# EAGLE board pandashield (EAGLE 6.0), part 1 of 2
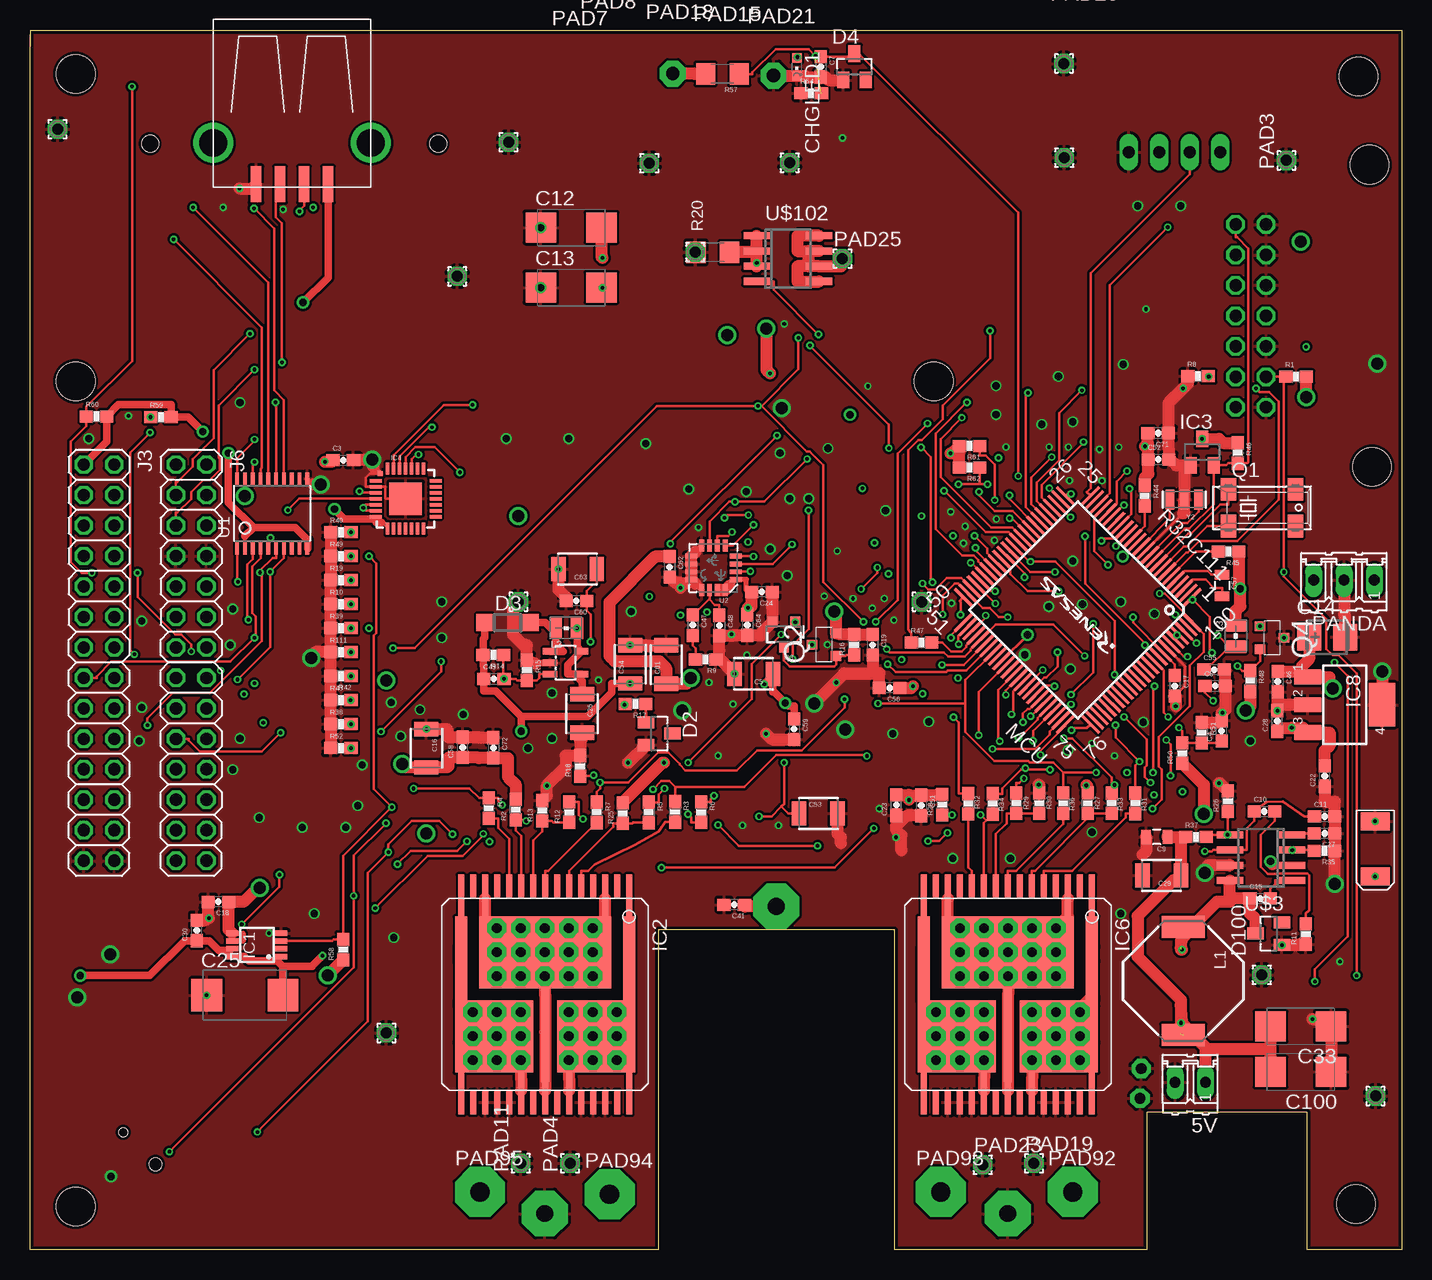
[diagram p9: board, top side]
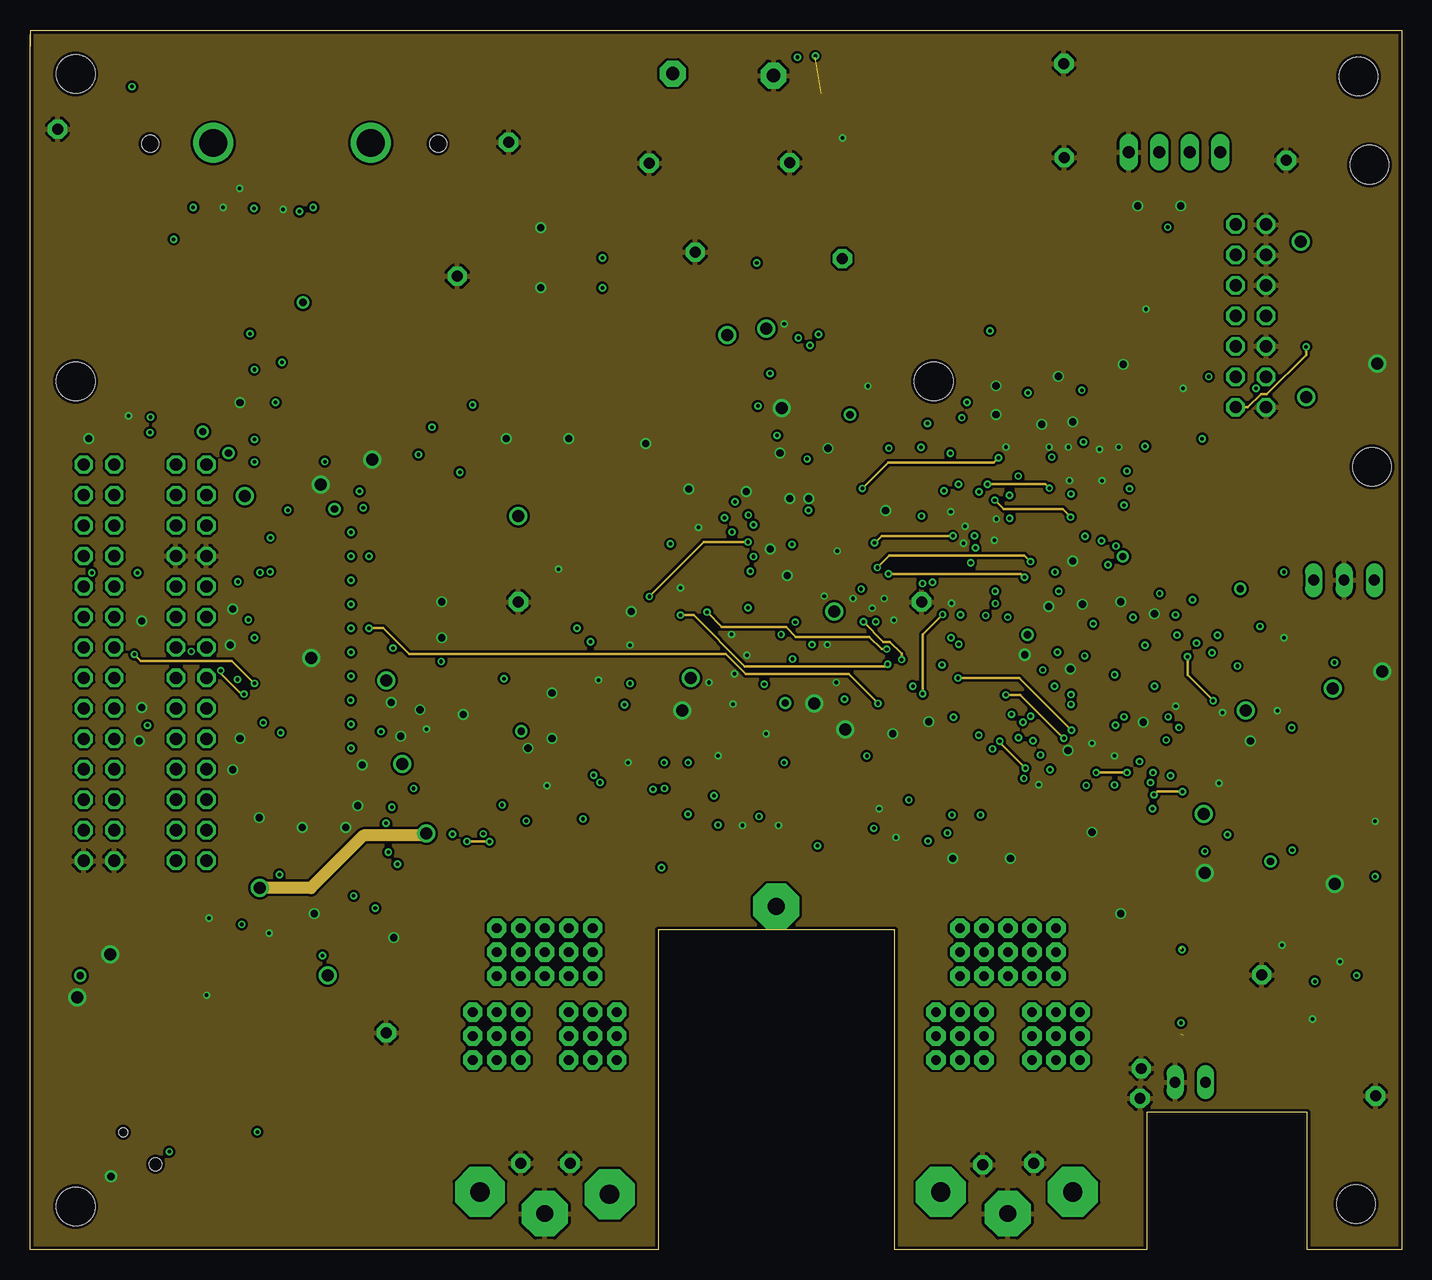
[diagram p10: board, inner layer Route2]
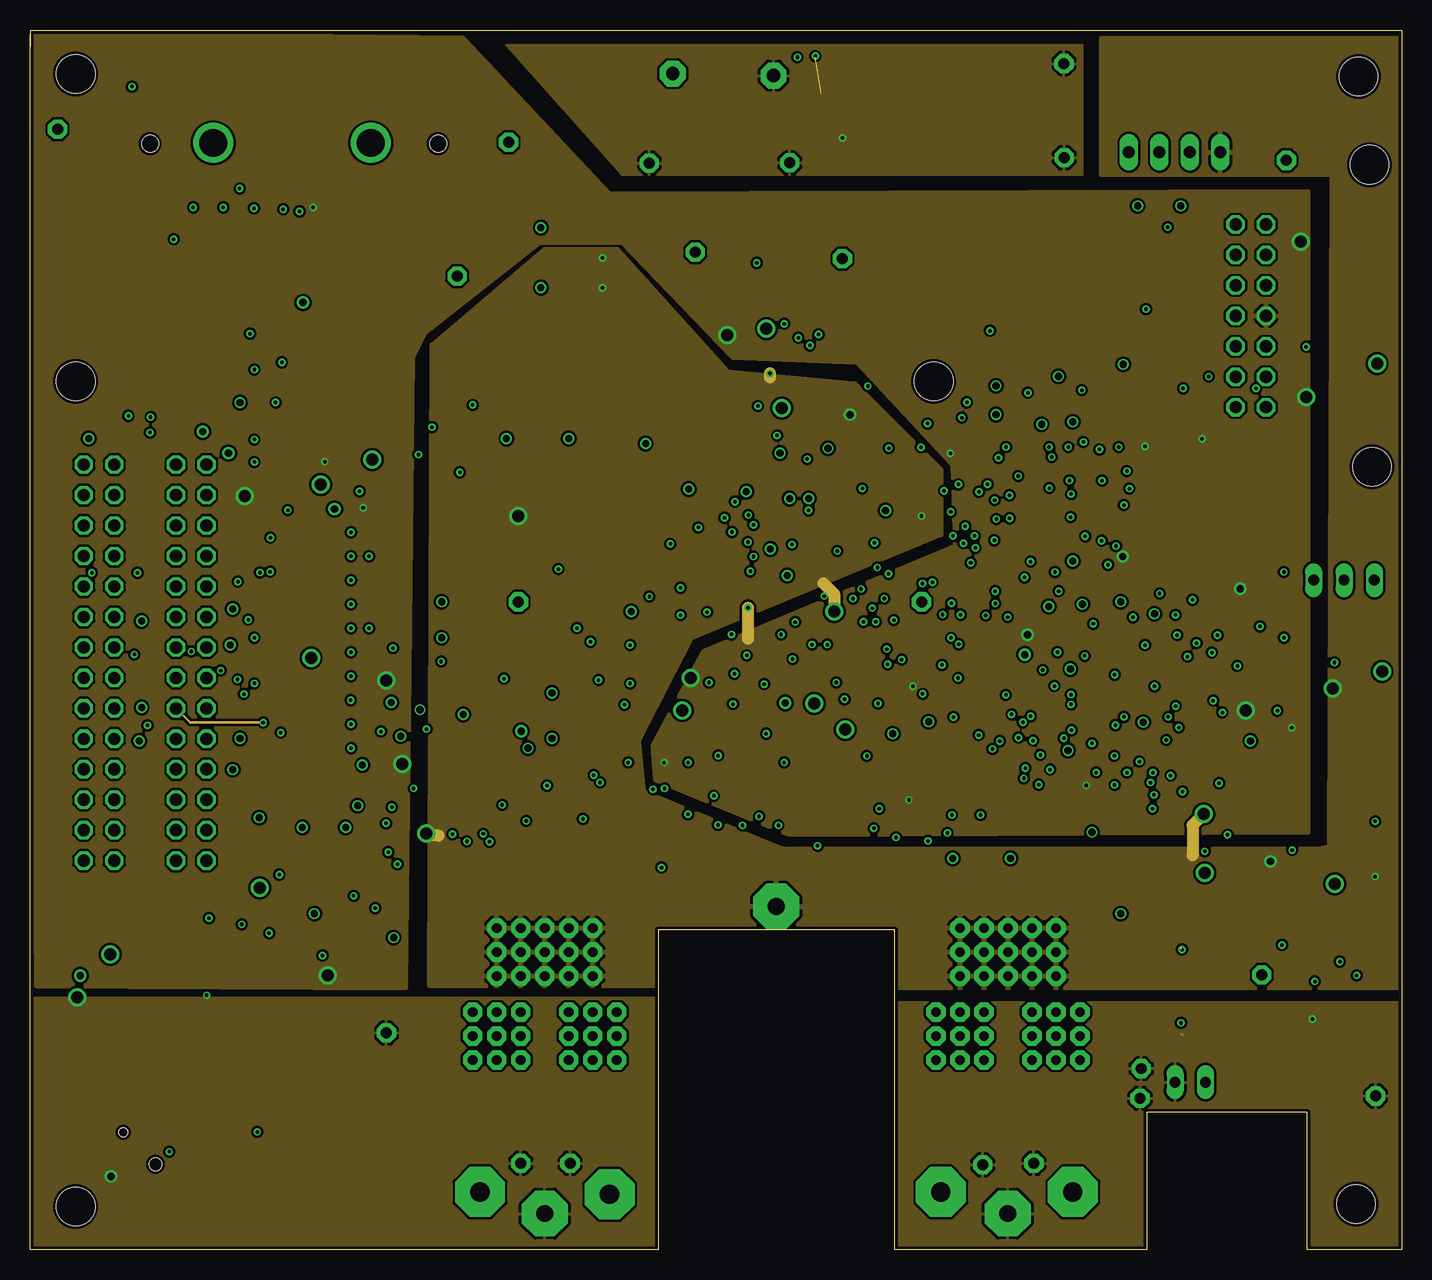
[diagram p11: board, inner layer Route15]
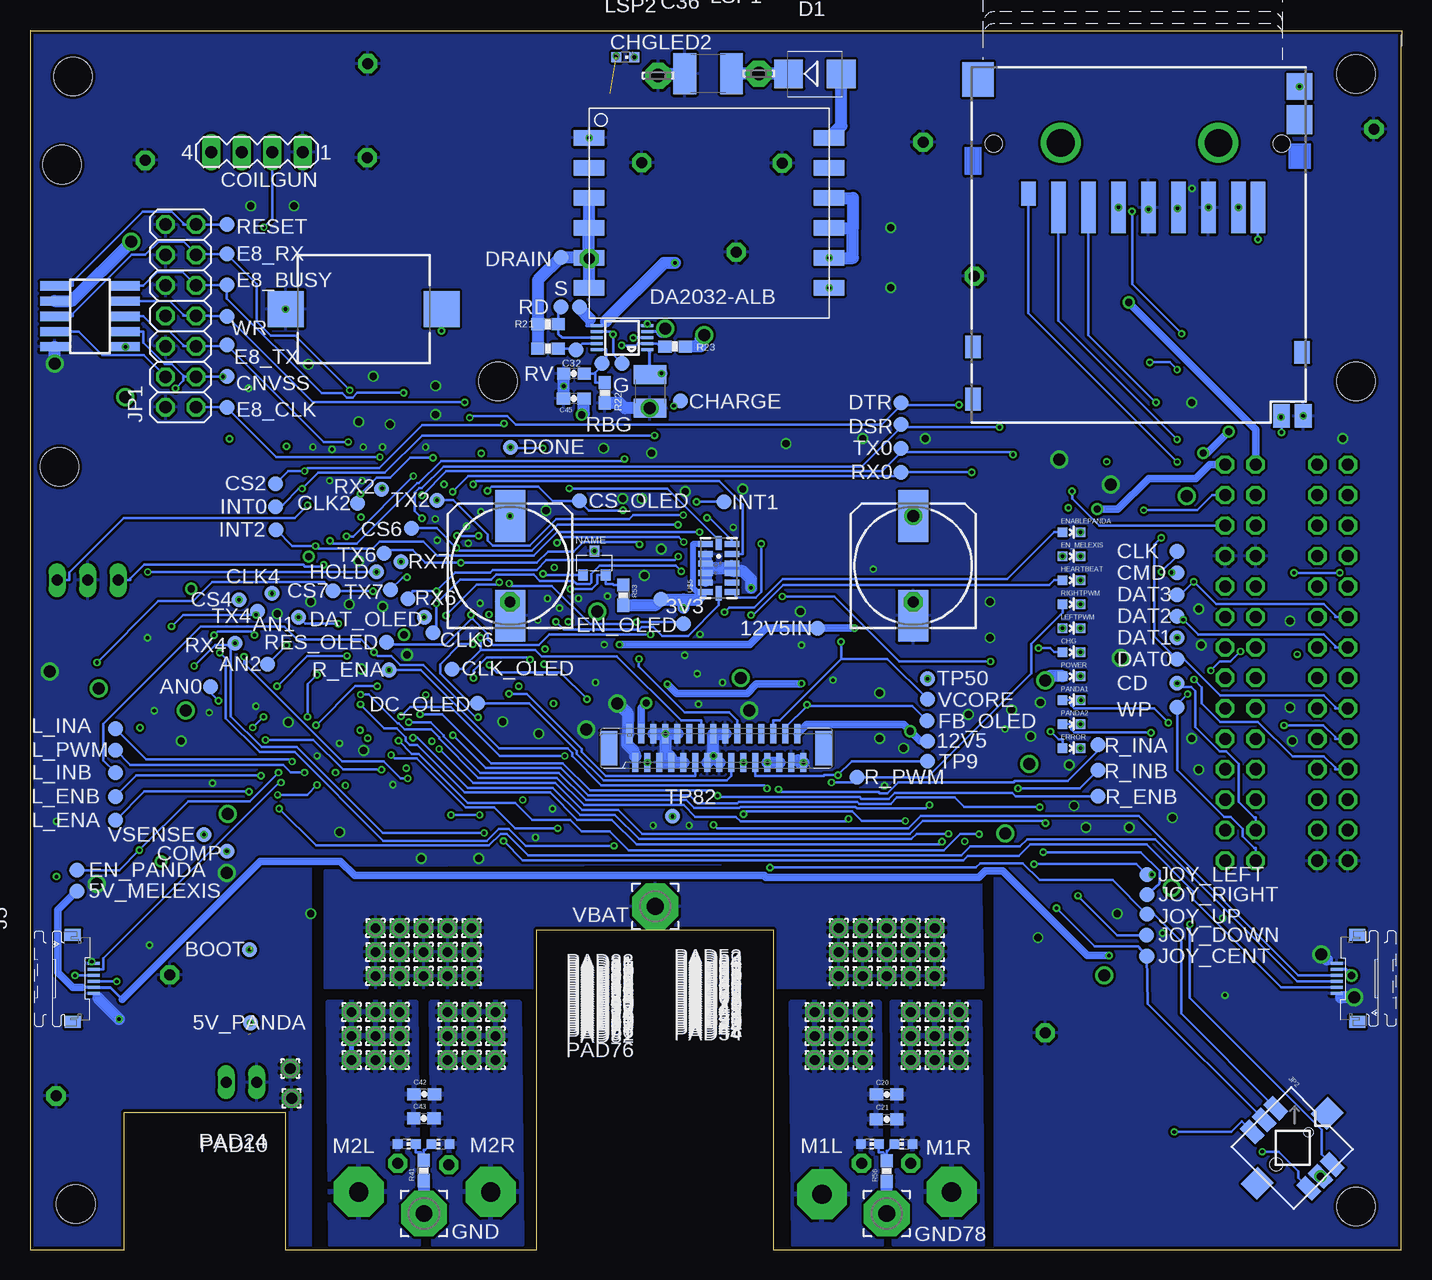
[diagram p12: board, bottom side, seen from below]

Size 114.3 x 101.67 mm. Coordinates in mm from the lower left corner, seen from the top.
Outline: 0.02,101.27 0.02,0 32.3,0 33.1,0 33.5,0 33.7,0 33.9,0 34.7,0 52.36,0 52.36,26.67 72.08,26.67 72.08,0 89.9,0 90.1,0 93.05,0 93.05,11.43 106.45,11.43 106.45,0 114.3,0 114.3,101.6
Outline: 114.3,101.67 114.3,101.6
Outline: 114.3,101.6 39.7,101.6 0,101.6 0,100.33
Copper layers (1*2+15*16): Top 0.035mm / dielectric 1.5mm / Route2 0.035mm / dielectric 0.15mm / Route15 0.035mm / dielectric 0.2mm / Bottom 0.035mm
Design rules: minimum track width 6mil, minimum drill 0.3mm, track to track 6mil, track to pad 6mil, pad to pad 6mil, via to via 6mil, smd to smd 0mil, copper to edge 10mil, drill to drill 10mil, minimum pad ring 10mil, minimum via ring 6mil, stop-mask expansion 2mil, vias tented up to drill 100mil, thermal gap 10mil
Net classes: 0 default: width 0.203 mm, drill 0.152 mm, clearance 0.203 mm; 1 power: width 0.635 mm, drill 0.305 mm, clearance 0.203 mm; 2 morepower: width 1.016 mm, drill 0.508 mm, clearance 0.203 mm
Holes 3.2 mm at 110.49,3.81 3.81,3.59 3.81,98.01 110.71,97.79 3.81,72.39 75.31,72.39 111.85,65.26 111.63,90.44

## Footprints (pad centres in the part's own frame; a part is rotated, then mirrored left to right if it is on the bottom)
B1,27 = smd 1.27 x 1.27: TP 0,0
02P = drill 0.914 long: 1 -1.27,0; 2 1.27,0
EIA6032 = smd 1.5 x 2.4: P$1 -2.3,0; P$2 2.3,0
153CLV-1014 = smd 4.3 x 2.5: + 4.15,0; - -4.15,0
0603-CAP = smd 1.1 x 1: 1 -0.85,0; 2 0.85,0
1210 = smd 1.2 x 2: 1 -1.6,0; 2 1.6,0
0805 = smd 0.8 x 1.2: 1 -0.9,0; 2 0.9,0
C/6032-28R = smd 2.55 x 2.5: + 2.525,0; - -2.525,0
CT3528 = smd 2 x 2.2: + -1.5,0; - 1.5,0
D/7343-31R = smd 2.55 x 2.7: + 3.175,0; - -3.175,0
C1210 = smd 1.6 x 2.7: 1 -1.4,0; 2 1.4,0
C1812 = smd 1.9 x 3.4: 1 -1.95,0; 2 1.95,0
LED-0603 = smd 0.8 x 0.8: A 0,-0.75; C 0,0.75
CHIPLED_0603 = smd 0.8 x 0.8: A 0,-0.75; C 0,0.75
MA04-1 = drill 1.016 long: 1 -3.81,0; 2 -1.27,0; 3 1.27,0; 4 3.81,0
SMB = smd 2.4 x 2.4: A 2.2,0; C -2.2,0
SOT23 = smd 1 x 1.4: 1 -0.95,-1.1; 2 0.95,-1.1; 3 0,1.1
SOD123 = smd 1.4 x 1.4: A 1.9,0; C -1.9,0
3,81/1,4 = drill 1.397 pad 3.81 octagon: 1 0,0
MSOP8 = smd 0.45 x 1: 1 -0.975,-2.05; 2 -0.325,-2.05; 3 0.325,-2.05; 4 0.975,-2.05; 5 0.975,2.05; 6 0.325,2.05; 7 -0.325,2.05; 8 -0.975,2.05
MULTIPOWERSO-30 = smd 0.508 x 12: 1 -7,-4; 15 7,-4; 16 7,4; 30 -7,4 | smd 0.508 x 2: 2 -6,-9; 4 -4,-9; 5 -3,-9; 6 -2,-9; 7 -1,-9; 8 0,-9; 9 1,-9; 10 2,-9; 11 3,-9; 12 4,-9; 14 6,-9; 17 6,9; 18 5,9; 19 4,9; 20 3,9; 22 1,9; 24 -1,9; 26 -3,9; 27 -4,9; 28 -5,9; 29 -6,9 | smd 0.508 x 4: 3 -5,-8; 13 5,-8; 21 2,8; 23 0,8; 25 -2,8 | smd 6.5 x 6: OUTA -4.25,3.5; OUTB 4.25,3.5 | smd 1 x 7.5: OUTA@1 -7,-2.755; OUTB@1 7,-2.755 | smd 11 x 6: VCC 0,-3.5 | smd 0.65 x 8.3: VCC@1 0,3.145
SOT23B-3 = smd 1 x 1.4: 1 -0.95,-1.1; 2 0.95,-1.1; 3 0,1.1
MLP28 = smd 1 x 0.3: 1 -2.5,1.5; 2 -2.5,1; 3 -2.5,0.5; 4 -2.5,0; 5 -2.5,-0.5; 6 -2.5,-1; 7 -2.5,-1.5; 15 2.5,-1.5; 16 2.5,-1; 17 2.5,-0.5; 18 2.5,0; 19 2.5,0.5; 20 2.5,1; 21 2.5,1.5 | smd 0.3 x 1: 8 -1.5,-2.5; 9 -1,-2.5; 10 -0.5,-2.5; 11 0,-2.5; 12 0.5,-2.5; 13 1,-2.5; 14 1.5,-2.5; 22 1.5,2.5; 23 1,2.5; 24 0.5,2.5; 25 0,2.5; 26 -0.5,2.5; 27 -1,2.5; 28 -1.5,2.5 | smd 2.7 x 2.7: EXP 0,0 | smd 0.435 x 0.435: M -2.103,2.103
SOT223 = smd 1.219 x 2.235: 1 -2.311,-3.099; 2 0,-3.099; 3 2.311,-3.099 | smd 3.6 x 2.2: 4 0,3.099
XF2J-3024-11 = smd 1.6 x 0.5: 1 1.2,7.25; 2 -1.2,6.75; 3 1.2,6.25; 4 -1.2,5.75; 5 1.2,5.25; 6 -1.2,4.75; 7 1.2,4.25; 8 -1.2,3.75; 9 1.2,3.25; 10 -1.2,2.75; 11 1.2,2.25; 12 -1.2,1.75; 13 1.2,1.25; 14 -1.2,0.75; 15 1.2,0.25; 16 -1.2,-0.25; 17 1.2,-0.75; 18 -1.2,-1.25; 19 1.2,-1.75; 20 -1.2,-2.25; 21 1.2,-2.75; 22 -1.2,-3.25; 23 1.2,-3.75; 24 -1.2,-4.25; 25 1.2,-4.75; 26 -1.2,-5.25; 27 1.2,-5.75; 28 -1.2,-6.25; 29 1.2,-6.75; 30 -1.2,-7.25 | smd 2.9 x 1.4: M1 0,8.95; M2 0,-8.95
2X14 = drill 1.016 octagon: 1 -16.51,-1.27; 2 -16.51,1.27; 3 -13.97,-1.27; 4 -13.97,1.27; 5 -11.43,-1.27; 6 -11.43,1.27; 7 -8.89,-1.27; 8 -8.89,1.27; 9 -6.35,-1.27; 10 -6.35,1.27; 11 -3.81,-1.27; 12 -3.81,1.27; 13 -1.27,-1.27; 14 -1.27,1.27; 15 1.27,-1.27; 16 1.27,1.27; 17 3.81,-1.27; 18 3.81,1.27; 19 6.35,-1.27; 20 6.35,1.27; 21 8.89,-1.27; 22 8.89,1.27; 23 11.43,-1.27; 24 11.43,1.27; 25 13.97,-1.27; 26 13.97,1.27; 27 16.51,-1.27; 28 16.51,1.27
XF2L-0625-1 = smd 1 x 0.25: 1 1.905,1.25; 2 1.905,0.75; 3 1.905,0.25; 4 1.905,-0.25; 5 1.905,-0.75; 6 1.905,-1.25 | smd 1.34 x 1: M1 0.18,3.638; M2 0.18,-3.638
2X07 = drill 1.016 octagon: 1 -7.62,-1.27; 2 -7.62,1.27; 3 -5.08,-1.27; 4 -5.08,1.27; 5 -2.54,-1.27; 6 -2.54,1.27; 7 0,-1.27; 8 0,1.27; 9 2.54,-1.27; 10 2.54,1.27; 11 5.08,-1.27; 12 5.08,1.27; 13 7.62,-1.27; 14 7.62,1.27
JOYSTICK_MINI = smd 1.85 x 1.1: A 0,2.8; B 6.65,2.8; C 0,0; CTR 0,1.4; D 6.65,0; GND 6.65,1.4 | smd 1.9 x 2: NC 3.325,5.53; NC@0 3.33,-2.72 | hole 0.75: 3.34,3.295 | hole 1.05: 3.325,-0.5
SRU1038 = smd 1.8 x 3.6: 1 -4.5,0; 2 4.5,0
WE-KI_0805_B = smd 1.02 x 1.78: 1 -0.89,0; 2 0.89,0
LSP11 = drill 1.118 pad 2.159 octagon: MP 0,0
MSOP = smd 0.25 x 1: 1 -1,-2.113; 2 -0.5,-2.113; 3 0,-2.113; 4 0.5,-2.113; 5 1,-2.113; 6 1,2.113; 7 0.5,2.113; 8 0,2.113; 9 -0.5,2.113; 10 -1,2.113
CHIP-LED0603 = smd 0.8 x 0.8: A 0,-0.75; C 0,0.75
100P6Q-A = smd 0.25 x 2: 1 -6,-7.5; 2 -5.5,-7.5; 3 -5,-7.5; 4 -4.5,-7.5; 5 -4,-7.5; 6 -3.5,-7.5; 7 -3,-7.5; 8 -2.5,-7.5; 9 -2,-7.5; 10 -1.5,-7.5; 11 -1,-7.5; 12 -0.5,-7.5; 13 0,-7.5; 14 0.5,-7.5; 15 1,-7.5; 16 1.5,-7.5; 17 2,-7.5; 18 2.5,-7.5; 19 3,-7.5; 20 3.5,-7.5; 21 4,-7.5; 22 4.5,-7.5; 23 5,-7.5; 24 5.5,-7.5; 25 6,-7.5; 51 6,7.5; 52 5.5,7.5; 53 5,7.5; 54 4.5,7.5; 55 4,7.5; 56 3.5,7.5; 57 3,7.5; 58 2.5,7.5; 59 2,7.5; 60 1.5,7.5; 61 1,7.5; 62 0.5,7.5; 63 0,7.5; 64 -0.5,7.5; 65 -1,7.5; 66 -1.5,7.5; 67 -2,7.5; 68 -2.5,7.5; 69 -3,7.5; 70 -3.5,7.5; 71 -4,7.5; 72 -4.5,7.5; 73 -5,7.5; 74 -5.5,7.5; 75 -6,7.5 | smd 2 x 0.25: 26 7.5,-6; 27 7.5,-5.5; 28 7.5,-5; 29 7.5,-4.5; 30 7.5,-4; 31 7.5,-3.5; 32 7.5,-3; 33 7.5,-2.5; 34 7.5,-2; 35 7.5,-1.5; 36 7.5,-1; 37 7.5,-0.5; 38 7.5,0; 39 7.5,0.5; 40 7.5,1; 41 7.5,1.5; 42 7.5,2; 43 7.5,2.5; 44 7.5,3; 45 7.5,3.5; 46 7.5,4; 47 7.5,4.5; 48 7.5,5; 49 7.5,5.5; 50 7.5,6; 76 -7.5,6; 77 -7.5,5.5; 78 -7.5,5; 79 -7.5,4.5; 80 -7.5,4; 81 -7.5,3.5; 82 -7.5,3; 83 -7.5,2.5; 84 -7.5,2; 85 -7.5,1.5; 86 -7.5,1; 87 -7.5,0.5; 88 -7.5,0; 89 -7.5,-0.5; 90 -7.5,-1; 91 -7.5,-1.5; 92 -7.5,-2; 93 -7.5,-2.5; 94 -7.5,-3; 95 -7.5,-3.5; 96 -7.5,-4; 97 -7.5,-4.5; 98 -7.5,-5; 99 -7.5,-5.5; 100 -7.5,-6
1,6/0,9 = drill 0.914 pad 1.6 octagon: 1 0,0
1,6/0,8 = drill 0.813 pad 1.6 octagon: 1 0,0
4,16O1,6 = drill 1.6 pad 4.166 octagon: 1 0,0
03P = drill 0.914 long: 1 -2.54,0; 2 0,0; 3 2.54,0
MM20SS = smd 1.27 x 1.88: 1 -2.794,-1.524; 2 2.794,-1.524; 3 2.794,1.524; 4 -2.794,1.524
MICRO3 = smd 0.8 x 0.9: 1 -0.95,-1; 2 0.95,-1; 3 0,1
SOT23-3 = smd 0.8 x 0.9: 1 -0.95,-1; 2 0.95,-1; 3 0,1.1
0603-RES = smd 1.1 x 1: 1 -0.85,0; 2 0.85,0
1206 = smd 1.6 x 1.8: 1 -1.4,0; 2 1.4,0
BUZZER-CMT1102 = smd 3 x 3: 1 -6.5,0; 2 6.5,0
TSSOP20 = smd 0.305 x 0.991: 1 -2.925,-2.918; 2 -2.275,-2.918; 3 -1.625,-2.918; 4 -0.975,-2.918; 5 -0.325,-2.918; 6 0.325,-2.918; 7 0.975,-2.918; 8 1.625,-2.918; 9 2.275,-2.918; 10 2.925,-2.918; 11 2.925,2.918; 12 2.275,2.918; 13 1.625,2.918; 14 0.975,2.918; 15 0.325,2.918; 16 -0.325,2.918; 17 -0.975,2.918; 18 -1.625,2.918; 19 -2.275,2.918; 20 -2.925,2.918
LGA16-4X4 = smd 1 x 0.4: 1 -1.85,0.975; 2 -1.85,0.325; 3 -1.85,-0.325; 4 -1.85,-0.975; 9 1.85,-0.975; 10 1.85,-0.325; 11 1.85,0.325; 12 1.85,0.975 | smd 0.4 x 1: 5 -0.975,-1.85; 6 -0.325,-1.85; 7 0.325,-1.85; 8 0.975,-1.85; 13 0.975,1.85; 14 0.325,1.85; 15 -0.325,1.85; 16 -0.975,1.85
DA2032-ALB = smd 2.54 x 1.27: 1 -10,6.27; 2 -10,3.77; 3 -10,1.27; 4 -10,-1.23; 5 -10,-3.73; 6 -10,-6.23; 7 10,-6.23; 8 10,-3.73; 9 10,-1.23; 10 10,1.27; 11 10,3.77; 12 10,6.27
SOT23-DBV = smd 0.55 x 1.2: 1 -0.95,-1.3; 2 0,-1.3; 3 0.95,-1.3; 4 0.95,1.3; 5 -0.95,1.3
SO8 = smd 0.6 x 2.2: 1 -1.905,-2.6; 2 -0.635,-2.6; 3 0.635,-2.6; 4 1.905,-2.6; 5 1.905,2.6; 6 0.635,2.6; 7 -0.635,2.6; 8 -1.905,2.6
LGA14 = smd 0.5 x 1.2: 1 2,1.1; 2 1.2,1.1; 3 0.4,1.1; 4 -0.4,1.1; 5 -1.2,1.1; 6 -2,1.1; 8 -2,-1.1; 9 -1.2,-1.1; 10 -0.4,-1.1; 11 0.4,-1.1; 12 1.2,-1.1; 13 2,-1.1 | smd 1.2 x 0.5: 7 -2.1,0; 14 2.1,0
1365-10 = smd 0.76 x 2.4: 1 -2.54,-2.95; 2 -2.54,2.95; 3 -1.27,-2.95; 4 -1.27,2.95; 5 0,-2.95; 6 0,2.95; 7 1.27,-2.95; 8 1.27,2.95; 9 2.54,-2.95; 10 2.54,2.95
USB-A-S = smd 3 x 0.9: D+ 3.45,-1; D- 3.45,1; GND 3.45,-3; VBUS 3.45,3 | drill 2.311: P$5 0,-6.566; P$6 0,6.566
SDBMF-009XXBXX2 = smd 1.2 x 4.3: 1 6.7,5.325; 2 4.2,5.325; 3 1.7,5.325; 4 -0.8,5.325; 5 -3.3,5.325; 6 -5.8,5.325; 7 -8.3,5.325; 8 -9.925,5.325 | smd 1.2 x 2: 9 9.2,4.175 | smd 2.1 x 2.4: M1 -13.4,-2 | smd 2.6 x 2.9: M2 13.4,-5.35 | smd 1.3 x 1.9: M3 -13.6,17.4; M4 13.8,16.95; M5 13.8,21.3 | smd 1.4 x 1.95: SW1 -11.9,22.7; SW3 -13.7,22.7 | smd 2.1 x 2.2: SW2 -13.4,-4.75 | hole 1.4: -11.9,0; 12.1,0
RESONATOR-SMD = smd 0.7 x 1.7: 1 -1.2,0; 2 0,0; 3 1.2,0

## Placement (x,y rotation side)
3V3  TPB1,27  [B1,27]  61.7,54.2 90 bottom
5V  [02P]  96.69,13.95 180 top
5V_MELEXIS  TPB1,27  [B1,27]  110.4,29.88 0 bottom
5V_PANDA  TPB1,27  [B1,27]  95.92,18.9 0 bottom
10UF/16V  [EIA6032]  112.1,33.4 90 top
12V5  TPB1,27  [B1,27]  39.52,42.4 0 bottom
12V5IN  TPB1,27  [B1,27]  48.67,51.81 90 bottom
AN0  TPB1,27  [B1,27]  99.27,46.92 0 bottom
AN1  TPB1,27  [B1,27]  91.92,52.71 0 bottom
AN2  TPB1,27  [B1,27]  94.5,48.8 0 bottom
BOOT  TPB1,27  [B1,27]  96,25.01 0 bottom
C1  820uF/16V  [153CLV-1014]  74.3,57 90 bottom
C2  820uF/16V  [153CLV-1014]  40.7,57 90 bottom
C3  0.1  [0603-CAP]  26.1,65.8 0 top
C4  33nF  [0603-CAP]  99.29,43.24 90 top
C5  10uF  [1210]  60.3,48 180 top
C7  33n  [0603-CAP]  65.9,98.6 270 top
C8  33nF  [0603-CAP]  98.76,47 0 top
C9  4,7uF/6.3V  [0805]  93.9,34.4 180 top
C10  180pF  [0603-CAP]  102.87,36.53 0 top
C11  12pF  [0603-CAP]  107.89,36.11 0 top
C12  100uF/16V  [C/6032-28R]  45.1,85.2 0 top
C13  100uF/16V  [C/6032-28R]  45.1,80.2 0 top
C14  22,0  [CT3528]  108.1,51.05 0 top
C15  0.1  [0603-CAP]  102.51,29.26 0 top
C16  10,0  [1210]  33.04,41.79 270 top
C17  33nF  [0603-CAP]  95.4,47 270 top
C18  0.1  [0603-CAP]  15.7,29 180 top
C19  0,1  [0603-CAP]  70.21,50.42 270 top
C20  0,1  [0603-CAP]  42.92,12.93 0 bottom
C21  0,22  [0603-CAP]  42.92,10.86 0 bottom
C22  0,1  [0603-CAP]  107.9,39.48 90 top
C23  0,1  [0603-CAP]  72.2,37.06 90 top
C24  10n  [0603-CAP]  61,54.83 180 top
C25  [D/7343-31R]  17.9,21.2 0 top
C26  10,0  [1210]  46,44.68 270 top
C27  15nF  [0603-CAP]  107.88,34.7 180 top
C28  0.1  [0603-CAP]  103.94,44.07 90 top
C29  10uF/6.3V  [1210]  94.3,31.2 180 top
C30  0.1  [0603-CAP]  13.9,26.6 90 top
C31  10u  [C1210]  62.63,71.54 270 bottom
C32  100p  [0603-CAP]  68.97,73.02 180 bottom
C33  47uF/16V  [C/6032-28R]  105.9,18.6 180 top
C36  0.1uF 600V  [C1812]  57.78,98.03 180 bottom
C41  0,1  [0603-CAP]  58.69,28.75 180 top
C42  0,1  [0603-CAP]  81.45,12.96 0 bottom
C43  0,22  [0603-CAP]  81.48,10.93 0 bottom
C45  0.1  [0603-CAP]  68.98,70.94 180 bottom
C46  1uF  [0603-CAP]  103.98,47.35 270 top
C47  470nF  [0603-CAP]  55.23,52.05 270 top
C48  10nF  [0603-CAP]  57.45,52.04 270 top
C49  100p  [0603-CAP]  38.65,47.58 0 top
C51  0,1  [0603-CAP]  74.27,37.03 270 top
C52  0,1  [0603-CAP]  94.04,65.87 0 top
C53  10uF  [1210]  65.69,36.36 0 top
C54  10uF  [1210]  50.01,48.79 90 top
C55  0,1  [0603-CAP]  98.68,48.35 0 top
C56  0,1  [0603-CAP]  71.63,46.81 180 top
C57  4,7uF  [0805]  99.34,55.36 270 top
C58  0,1  [0603-CAP]  36.07,41.86 90 top
C59  0.1  [0603-CAP]  63.68,43.38 270 top
C60  0.1  [0603-CAP]  45.54,54.08 180 top
C61  10uF  [1210]  53.02,48.76 90 top
C62  0.1  [0603-CAP]  53.29,56.91 270 top
C63  10uF  [1210]  45.63,56.73 180 top
C64  0.1  [0603-CAP]  59.78,52.07 270 top
C71  0,1  [0603-CAP]  94.01,68.06 180 top
C72  0,1  [0603-CAP]  38.62,41.82 270 top
C100  47uF/16V  [C/6032-28R]  105.9,14.8 180 top
CD  TPB1,27  [B1,27]  18.7,47.2 0 bottom
CHARGE  TPB1,27  [B1,27]  60.11,70.74 90 bottom
CHG  [LED-0603]  27.5,49.8 270 bottom
CHGLED1  [CHIPLED_0603]  63.9,98.6 180 top
CHGLED2  [CHIPLED_0603]  64.7,99.4 270 bottom
CLK  TPB1,27  [B1,27]  18.7,58.2 0 bottom
CLK2  TPB1,27  [B1,27]  87,62.2 0 bottom
CLK4  TPB1,27  [B1,27]  94.14,54.69 0 bottom
CLK6  TPB1,27  [B1,27]  80.71,51.4 0 bottom
CLK_OLED  TPB1,27  [B1,27]  79.12,48.39 90 bottom
CMD  TPB1,27  [B1,27]  18.7,56.4 0 bottom
CNVSS  TPB1,27  [B1,27]  97.9,72.8 0 bottom
COILGUN  [MA04-1]  95.38,91.49 180 bottom
COMP  TPB1,27  [B1,27]  97.9,33.2 0 bottom
CS2  TPB1,27  [B1,27]  93.83,63.85 0 bottom
CS4  TPB1,27  [B1,27]  96.88,54.17 0 bottom
CS6  TPB1,27  [B1,27]  82.51,60.13 180 bottom
CS7  TPB1,27  [B1,27]  89.04,54.91 0 bottom
CS_OLED  TPB1,27  [B1,27]  68.51,62.4 270 bottom
D1  MURS160  [SMB]  48.89,98.01 0 bottom
D2  BAS70-04  [SOT23]  52.43,43.01 270 top
D3  MBR0530  [SOD123]  39.8,52.26 0 top
D4  BAT54  [SOT23]  68.7,98.6 0 top
D100  BAT54  [SOT23]  103.23,26.34 90 top
DAT0  TPB1,27  [B1,27]  18.7,49.2 0 bottom
DAT1  TPB1,27  [B1,27]  18.7,51 0 bottom
DAT2  TPB1,27  [B1,27]  18.7,52.8 0 bottom
DAT3  TPB1,27  [B1,27]  18.7,54.6 0 bottom
DAT_OLED  TPB1,27  [B1,27]  81.41,52.72 0 bottom
DC_OLED  TPB1,27  [B1,27]  77.03,45.53 180 bottom
DONE  TPB1,27  [B1,27]  74.25,66.89 0 bottom
DRAIN  TPB1,27  [B1,27]  70.05,82.72 90 bottom
DSR  TPB1,27  [B1,27]  41.7,68.8 0 bottom
DTR  TPB1,27  [B1,27]  41.7,70.6 0 bottom
E8_BUSY  TPB1,27  [B1,27]  97.9,80.4 0 bottom
E8_CLK  TPB1,27  [B1,27]  97.9,70.2 0 bottom
E8_RX  TPB1,27  [B1,27]  97.9,83 0 bottom
E8_TX  TPB1,27  [B1,27]  97.9,75.4 0 bottom
EN_MELEXIS  [LED-0603]  27.5,57.8 270 bottom
EN_OLED  TPB1,27  [B1,27]  59.83,52.16 180 bottom
EN_PANDA  TPB1,27  [B1,27]  110.4,31.63 0 bottom
ENABLEPANDA  [LED-0603]  27.5,59.8 270 bottom
ERROR  [LED-0603]  27.5,41.8 270 bottom
FB_OLED  TPB1,27  [B1,27]  39.53,44.09 90 bottom
G  TPB1,27  [B1,27]  64.97,73.88 90 bottom
GND  [3,81/1,4]  81.47,3 0 bottom
GND78  [3,81/1,4]  42.9,3 0 bottom
HEARTBEAT  [LED-0603]  27.5,55.8 270 bottom
HOLD  TPB1,27  [B1,27]  85.42,56.49 0 bottom
IC1  TPS773  [MSOP8]  18.9,25.4 90 top
IC2  VNH2SP30TR-E  [MULTIPOWERSO-30]  42.93,21.26 180 top
IC3  MAX803T  [SOT23B-3]  97.68,66.48 0 top
IC4  CP2103_USB_UART  [MLP28]  31.3,62.6 0 top
IC6  VNH2SP30TR-E  [MULTIPOWERSO-30]  81.49,21.27 180 top
IC8  LM2936MP-3.3  [SOT223]  109.57,45.42 270 top
INT0  TPB1,27  [B1,27]  93.84,61.92 0 bottom
INT1  TPB1,27  [B1,27]  56.48,62.34 270 bottom
INT2  TPB1,27  [B1,27]  93.8,60 90 bottom
J1  XF2J-3024-11  [XF2J-3024-11]  57.1,41.8 90 bottom
J3  [2X14]  5.75,48.93 270 top
J4  XF2L-0625-1  [XF2L-0625-1]  3.5,22.6 180 bottom
J5  XF2L-0625-1  [XF2L-0625-1]  110.9,22.6 0 bottom
J6  [2X14]  13.44,48.93 270 top
JOY_CENT  TPB1,27  [B1,27]  21.24,24.45 0 bottom
JOY_DOWN  TPB1,27  [B1,27]  21.24,26.21 0 bottom
JOY_LEFT  TPB1,27  [B1,27]  21.23,31.25 0 bottom
JOY_RIGHT  TPB1,27  [B1,27]  21.23,29.58 0 bottom
JOY_UP  TPB1,27  [B1,27]  21.23,27.95 0 bottom
JP1  [2X07]  101.74,77.84 90 bottom
JP2  JOYSTICK_MINI4UCON  [JOYSTICK_MINI]  12.45,9.81 315 bottom
L1  [SRU1038]  96.1,22.4 270 top
L2  10uH  [WE-KI_0805_B]  44.7,51.8 0 top
L3  4,7uH  [WE-KI_0805_B]  100.48,51.14 270 top
L_ENA  TPB1,27  [B1,27]  107.16,35.78 0 bottom
L_ENB  TPB1,27  [B1,27]  107.18,37.76 0 bottom
L_INA  TPB1,27  [B1,27]  107.18,43.44 0 bottom
L_INB  TPB1,27  [B1,27]  107.16,39.76 0 bottom
L_PWM  TPB1,27  [B1,27]  107.16,41.64 0 bottom
LEFTPWM  [LED-0603]  27.5,51.8 270 bottom
LSP1  LSP11  [LSP11]  53.56,98.03 180 bottom
LSP2  LSP11  [LSP11]  61.96,97.86 180 bottom
LT3750  LT3750  [MSOP]  64.97,76.01 90 bottom
M1L  [CHIP-LED0603]  44.3,8.8 270 bottom
M1R  [CHIP-LED0603]  41.5,8.8 90 bottom
M2L  [CHIP-LED0603]  82.9,8.8 270 bottom
M2R  [CHIP-LED0603]  80.1,8.8 90 bottom
MCU  R32C111  [100P6Q-A]  87.32,53.32 135 top
PAD3  [1,6/0,9]  104.7,90.8 90 top
PAD4  [1,6/0,9]  45,7.19 90 top
PAD7  [1,6/0,9]  39.88,92.31 90 top
PAD8  [1,6/0,9]  35.61,81.14 90 top
PAD9  [1,6/0,9]  86.18,91.03 90 top
PAD10  [1,6/0,9]  92.61,15.09 90 bottom
PAD11  [1,6/0,9]  40.9,7.2 90 top
PAD12  [1,6/0,9]  74.3,54 90 top
PAD13  [1,6/0,9]  40.7,54 90 top
PAD14  [1,6/0,9]  29.7,18.06 90 top
PAD15  [1,6/0,9]  51.62,90.57 0 top
PAD16  [1,6/0,9]  102.65,22.9 0 top
PAD17  [1,6/0,9]  112.13,12.8 0 top
PAD18  [1,6/0,9]  55.44,83.15 0 top
PAD19  [1,6/0,9]  83.66,7.19 0 top
PAD20  [1,6/0,9]  86.17,98.88 0 top
PAD21  [1,6/0,9]  63.32,90.6 0 top
PAD22  [1,6/0,9]  2.3,93.4 0 top
PAD23  [1,6/0,9]  79.4,7.06 0 top
PAD24  [1,6/0,9]  92.5,12.6 0 bottom
PAD25  [1,6/0,9]  67.7,82.6 0 top
PAD26  WIREPAD1,6/0,8  [1,6/0,8]  77.5,26.8 0 bottom
PAD27  WIREPAD1,6/0,8  [1,6/0,8]  85.5,26.8 0 bottom
PAD28  WIREPAD1,6/0,8  [1,6/0,8]  79.5,24.8 0 bottom
PAD29  WIREPAD1,6/0,8  [1,6/0,8]  79.5,22.8 0 bottom
PAD30  WIREPAD1,6/0,8  [1,6/0,8]  83.5,26.8 0 bottom
PAD31  WIREPAD1,6/0,8  [1,6/0,8]  81.5,22.8 0 bottom
PAD32  WIREPAD1,6/0,8  [1,6/0,8]  77.5,24.8 0 bottom
PAD33  WIREPAD1,6/0,8  [1,6/0,8]  81.5,26.8 0 bottom
PAD34  WIREPAD1,6/0,8  [1,6/0,8]  85.5,24.8 0 bottom
PAD35  WIREPAD1,6/0,8  [1,6/0,8]  83.5,24.8 0 bottom
PAD36  WIREPAD1,6/0,8  [1,6/0,8]  85.5,22.8 0 bottom
PAD37  WIREPAD1,6/0,8  [1,6/0,8]  79.5,26.8 0 bottom
PAD38  WIREPAD1,6/0,8  [1,6/0,8]  81.5,24.8 0 bottom
PAD39  WIREPAD1,6/0,8  [1,6/0,8]  77.5,22.8 0 bottom
PAD40  WIREPAD1,6/0,8  [1,6/0,8]  83.5,22.8 0 bottom
PAD41  WIREPAD1,6/0,8  [1,6/0,8]  40.9,22.8 0 bottom
PAD42  WIREPAD1,6/0,8  [1,6/0,8]  46.9,26.8 0 bottom
PAD43  WIREPAD1,6/0,8  [1,6/0,8]  38.9,24.8 0 bottom
PAD44  WIREPAD1,6/0,8  [1,6/0,8]  42.9,24.8 0 bottom
PAD45  WIREPAD1,6/0,8  [1,6/0,8]  38.9,22.8 0 bottom
PAD46  WIREPAD1,6/0,8  [1,6/0,8]  46.9,22.8 0 bottom
PAD47  WIREPAD1,6/0,8  [1,6/0,8]  44.9,24.8 0 bottom
PAD48  WIREPAD1,6/0,8  [1,6/0,8]  40.9,24.8 0 bottom
PAD49  WIREPAD1,6/0,8  [1,6/0,8]  42.9,26.8 0 bottom
PAD50  WIREPAD1,6/0,8  [1,6/0,8]  38.9,26.8 0 bottom
PAD51  WIREPAD1,6/0,8  [1,6/0,8]  40.9,26.8 0 bottom
PAD52  WIREPAD1,6/0,8  [1,6/0,8]  42.9,22.8 0 bottom
PAD53  WIREPAD1,6/0,8  [1,6/0,8]  44.9,26.8 0 bottom
PAD54  WIREPAD1,6/0,8  [1,6/0,8]  46.9,24.8 0 bottom
PAD55  WIREPAD1,6/0,8  [1,6/0,8]  44.9,22.8 0 bottom
PAD56  WIREPAD1,6/0,8  [1,6/0,8]  48.9,15.8 0 bottom
PAD57  WIREPAD1,6/0,8  [1,6/0,8]  44.9,17.8 0 bottom
PAD58  WIREPAD1,6/0,8  [1,6/0,8]  46.9,19.8 0 bottom
PAD59  WIREPAD1,6/0,8  [1,6/0,8]  48.9,19.8 0 bottom
PAD60  WIREPAD1,6/0,8  [1,6/0,8]  46.9,15.8 0 bottom
PAD61  WIREPAD1,6/0,8  [1,6/0,8]  44.9,19.8 0 bottom
PAD62  WIREPAD1,6/0,8  [1,6/0,8]  44.9,15.8 0 bottom
PAD63  WIREPAD1,6/0,8  [1,6/0,8]  46.9,17.8 0 bottom
PAD64  WIREPAD1,6/0,8  [1,6/0,8]  48.9,17.8 0 bottom
PAD65  WIREPAD1,6/0,8  [1,6/0,8]  40.9,19.8 0 bottom
PAD66  WIREPAD1,6/0,8  [1,6/0,8]  40.9,17.8 0 bottom
PAD67  WIREPAD1,6/0,8  [1,6/0,8]  40.9,15.8 0 bottom
PAD68  WIREPAD1,6/0,8  [1,6/0,8]  36.9,15.8 0 bottom
PAD69  WIREPAD1,6/0,8  [1,6/0,8]  36.9,19.8 0 bottom
PAD70  WIREPAD1,6/0,8  [1,6/0,8]  38.9,15.8 0 bottom
PAD71  WIREPAD1,6/0,8  [1,6/0,8]  38.9,19.8 0 bottom
PAD72  WIREPAD1,6/0,8  [1,6/0,8]  38.9,17.8 0 bottom
PAD73  WIREPAD1,6/0,8  [1,6/0,8]  36.9,17.8 0 bottom
PAD74  WIREPAD1,6/0,8  [1,6/0,8]  85.5,17.8 0 bottom
PAD75  WIREPAD1,6/0,8  [1,6/0,8]  85.5,15.8 0 bottom
PAD76  WIREPAD1,6/0,8  [1,6/0,8]  87.5,19.8 0 bottom
PAD77  WIREPAD1,6/0,8  [1,6/0,8]  87.5,17.8 0 bottom
PAD78  WIREPAD1,6/0,8  [1,6/0,8]  83.5,17.8 0 bottom
PAD79  WIREPAD1,6/0,8  [1,6/0,8]  85.5,19.8 0 bottom
PAD80  WIREPAD1,6/0,8  [1,6/0,8]  83.5,15.8 0 bottom
PAD81  WIREPAD1,6/0,8  [1,6/0,8]  83.5,19.8 0 bottom
PAD82  WIREPAD1,6/0,8  [1,6/0,8]  87.5,15.8 0 bottom
PAD83  WIREPAD1,6/0,8  [1,6/0,8]  79.5,15.8 0 bottom
PAD84  WIREPAD1,6/0,8  [1,6/0,8]  77.5,19.8 0 bottom
PAD85  WIREPAD1,6/0,8  [1,6/0,8]  75.5,19.8 0 bottom
PAD86  WIREPAD1,6/0,8  [1,6/0,8]  77.5,15.8 0 bottom
PAD87  WIREPAD1,6/0,8  [1,6/0,8]  77.5,17.8 0 bottom
PAD88  WIREPAD1,6/0,8  [1,6/0,8]  75.5,17.8 0 bottom
PAD89  WIREPAD1,6/0,8  [1,6/0,8]  79.5,19.8 0 bottom
PAD90  WIREPAD1,6/0,8  [1,6/0,8]  79.5,17.8 0 bottom
PAD91  WIREPAD1,6/0,8  [1,6/0,8]  75.5,15.8 0 bottom
PAD92  WIREPAD4,16O1,6  [4,16O1,6]  86.9,4.8 0 top
PAD93  WIREPAD4,16O1,6  [4,16O1,6]  75.9,4.8 0 top
PAD94  WIREPAD4,16O1,6  [4,16O1,6]  48.3,4.6 0 top
PAD95  WIREPAD4,16O1,6  [4,16O1,6]  37.5,4.8 0 top
PANDA  [03P]  109.5,55.8 180 top
PANDA1  [LED-0603]  27.5,45.8 270 bottom
PANDA2  [LED-0603]  27.5,43.8 270 bottom
POWER  [LED-0603]  27.5,47.8 270 bottom
Q1  [MM20SS]  102.67,61.84 0 top
Q2  IRLML6401  [MICRO3]  66.17,50.43 90 top
Q3  [SOT23-3]  62.82,51.31 180 top
Q4  IRLML6401  [MICRO3]  103.5,51 270 top
Q5  IRLML6401  [MICRO3]  67.27,57.23 0 bottom
R1  4k7  [0603-RES]  105.51,72.77 0 top
R2  3k3  [0603-RES]  40.47,36.66 90 top
R3  1k  [0603-RES]  53.75,36.48 270 top
R4  1k  [0603-RES]  38.23,36.79 270 top
R5  1k  [0603-RES]  51.58,36.44 270 top
R6  1k  [0603-RES]  55.92,36.48 270 top
R7  1k  [0603-RES]  47.22,36.44 270 top
R8  4k7  [0603-RES]  97.35,72.81 0 top
R9  10k  [0603-RES]  56.31,49.2 180 top
R10  1k  [0603-RES]  25.9,53.8 0 top
R11  63k4  [0603-RES]  106.33,26.31 90 top
R12  10k  [0603-RES]  44.94,36.47 90 top
R13  1k5  [0603-RES]  42.69,36.57 90 top
R14  117k  [0603-RES]  38.61,49.58 180 top
R15  13k3  [0603-RES]  41.41,48.29 270 top
R16  10k  [0603-RES]  68.67,50.43 90 top
R17  51r  [0603-RES]  50.46,45.48 180 top
R18  680k  [0603-RES]  45.84,40.31 90 top
R19  1k  [0603-RES]  25.9,55.8 0 top
R20  8m  [1206]  56.89,83.13 180 top
R21  43k  [0603-RES]  71.12,77.13 180 bottom
R22  1.87k  [0603-RES]  66.39,71.43 270 bottom
R23  10k  [0603-RES]  60.54,75.29 180 bottom
R24  60.4k  [0603-RES]  71.13,75.1 180 bottom
R25  3k3  [0603-RES]  49.39,36.39 90 top
R26  1k87  [0603-RES]  99.83,37.38 90 top
R27  3k3  [0603-RES]  88.14,37.21 90 top
R28  3k3  [0603-RES]  76.02,37.09 90 top
R29  10k  [0603-RES]  82.2,37.2 90 top
R30  1k5  [0603-RES]  84.11,37.22 90 top
R31  1k  [0603-RES]  92.12,37.19 270 top
R32  1k  [0603-RES]  78.2,37.16 270 top
R33  1k  [0603-RES]  90.14,37.2 270 top
R34  1k  [0603-RES]  80.23,37.15 270 top
R35  100k  [0603-RES]  107.88,33.25 180 top
R36  1k  [0603-RES]  86.11,37.2 270 top
R37  10k  [0603-RES]  97.16,34.39 0 top
R38  1k  [0603-RES]  25.9,43.8 0 top
R39  1k  [0603-RES]  25.9,51.8 0 top
R40  1k  [0603-RES]  25.9,59.8 0 top
R41  1k  [0603-RES]  81.5,6.6 90 bottom
R42  1k  [0603-RES]  25.9,47.8 180 top
R43  1k  [0603-RES]  25.9,45.8 0 top
R44  4k7  [0603-RES]  92.91,62.85 270 top
R45  4k7  [0603-RES]  99.89,58.18 180 top
R46  4k7  [0603-RES]  100.64,66.4 270 top
R47  1k  [0603-RES]  74.3,50.6 0 top
R48  4k7  [0603-RES]  101.7,47.4 270 top
R49  1k  [0603-RES]  25.9,57.8 0 top
R50  4k7  [0603-RES]  96.02,41.39 90 top
R51  1k5  [0603-RES]  97.65,43.09 270 top
R52  1k  [0603-RES]  25.9,41.8 0 top
R53  4k7  [0603-RES]  64.86,54.55 270 bottom
R54  3k12  [0603-RES]  65.1,96.4 0 top
R56  1k  [0603-RES]  42.9,6.54 90 bottom
R57  430k  [1206]  57.7,98 180 top
R58  10k  [0603-RES]  26.1,25 90 top
R59  10k  [0603-RES]  10.9,69.4 0 top
R60  10k  [0603-RES]  5.55,69.46 0 top
R61  4k7  [0603-RES]  78.3,67 180 top
R62  4k7  [0603-RES]  78.3,65.2 180 top
R111  1k  [0603-RES]  25.9,49.8 0 top
R_ENA  TPB1,27  [B1,27]  84.39,48.32 0 bottom
R_ENB  TPB1,27  [B1,27]  25.28,37.78 0 bottom
R_INA  TPB1,27  [B1,27]  25.3,42.1 180 bottom
R_INB  TPB1,27  [B1,27]  25.31,39.95 180 bottom
R_PWM  TPB1,27  [B1,27]  45.38,39.37 0 bottom
RBG  TPB1,27  [B1,27]  66.64,73.88 90 bottom
RD  TPB1,27  [B1,27]  70.05,78.59 90 bottom
RES_OLED  TPB1,27  [B1,27]  84.6,50.61 90 bottom
RESET  TPB1,27  [B1,27]  97.9,85.46 0 bottom
RIGHTPWM  [LED-0603]  27.5,53.8 270 bottom
RV  TPB1,27  [B1,27]  68.82,74.99 90 bottom
RX0  TPB1,27  [B1,27]  41.7,64.8 0 bottom
RX2  TPB1,27  [B1,27]  84.99,63.39 0 bottom
RX4  TPB1,27  [B1,27]  97.2,50.56 0 bottom
RX6  TPB1,27  [B1,27]  82.8,54.27 90 bottom
RX7  TPB1,27  [B1,27]  83.38,57.35 0 bottom
S  TPB1,27  [B1,27]  68.5,78.6 90 bottom
SG2  BUZZERSMD3  [BUZZER-CMT1102]  86.5,78.4 180 bottom
TP9  TPB1,27  [B1,27]  39.52,40.71 90 bottom
TP50  TPB1,27  [B1,27]  39.5,47.59 0 bottom
TP82  TPB1,27  [B1,27]  60.76,36.11 0 bottom
TX0  TPB1,27  [B1,27]  41.7,66.8 0 bottom
TX2  TPB1,27  [B1,27]  80.4,62.48 0 bottom
TX4  TPB1,27  [B1,27]  95.34,53.2 0 bottom
TX6  TPB1,27  [B1,27]  84.81,58.03 90 bottom
TX7  TPB1,27  [B1,27]  84.28,55 0 bottom
U1  txb0108  [TSSOP20]  20.19,61.37 0 top
U2  L3G4200D  [LGA16-4X4]  56.95,56.83 180 top
U$1  DA2032-ALBDA2032-ALB  [DA2032-ALB]  57.7,86.4 0 bottom
U$2  LM2733  [SOT23-DBV]  44.64,48.92 270 top
U$3  TPS54233  [SO8]  102.59,32.67 90 top
U$5  MMA7455L  [LGA14]  56.9,56.8 90 bottom
U$102  IRF7855PBF  [SO8]  63.16,82.61 270 top
VBAT  [3,81/1,4]  62.19,28.6 0 bottom
VCORE  TPB1,27  [B1,27]  39.5,45.88 90 bottom
VSENSE  TPB1,27  [B1,27]  99.8,34.58 0 bottom
WP  TPB1,27  [B1,27]  18.7,45.2 0 bottom
WR  TPB1,27  [B1,27]  97.9,77.8 0 bottom
X1  1365-10  [1365-10]  109.3,77.8 90 bottom
X4  USB-A-S  [USB-A-S]  21.84,92.26 270 top
X7  SDBMF  [SDBMF-009XXBXX2]  21.9,92.2 180 bottom
Y2  RESONATORSMD  [RESONATOR-SMD]  96.19,62.52 180 top